# Altium schematic sheet Power.SchDoc
size A
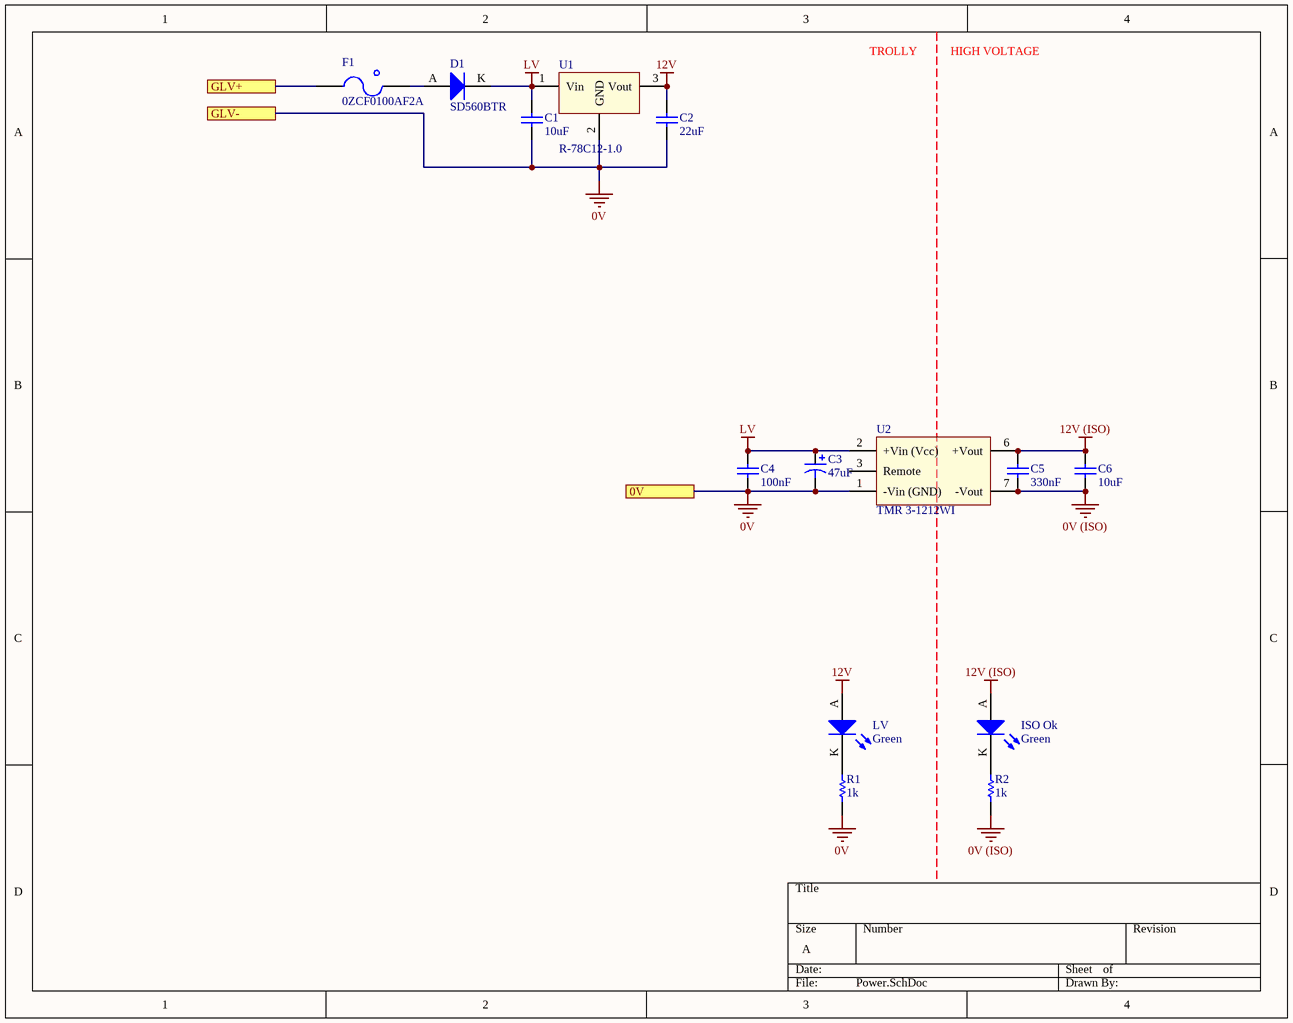
[diagram p0: Power.SchDoc]

## Parts
C1  10uF  [0805]
C2  22uF  [1206]
C3  47uF  [2924]
C4  100nF  [0805]
C5  330nF  [0805]
C6  10uF  [0805]
D1  SD560BTR  [SMB Diode]
F1  0ZCF0100AF2A  [2920]
ISO_Ok  Green  [0805 LED]
LV  Green  [0805 LED]
R1  1k  [0805]
R2  1k  [0805]
U1  R-78C12-1.0  [RECOM 3-SIP]
U2  TMR 3-1212WI  [TRECO 8-SIP]

## Ports
0V, GLV+, GLV-

## Nets
0V: C1.1 C2.1 C3.1 C4.1 R1.1 U1.2(GND) U2.1(-Vin_(GND)) ; port GLV-, port 0V
0V (ISO): C5.1 C6.1 R2.1 U2.7(-Vout)
12V: C2.2 LV.A U1.3(Vout)
12V (ISO): C5.2 C6.2 ISO_Ok.A U2.6(+Vout)
LV: C1.2 C3.2 C4.2 D1.K U1.1(Vin) U2.2(+Vin_(Vcc))
GLV+: F1.1 ; port GLV+
NetD1_A: D1.A F1.2
NetISO_Ok_K: ISO_Ok.K R2.2
NetLV_K: LV.K R1.2

Not connected (* = marked no-connect by the designer): U2 3(Remote)

## Notes on the sheet
- TROLLY
- HIGH VOLTAGE

## Library data of the parts
C1 C6 = GRM21BR6YA106KE43L: Manufacturer: muRata; Tolerance: 10%; Material: X5R; Rated Voltage: 50V; Part Number: GRM21BR6YA106KE43L; Value: 10uF; Digikey Part Number: 490-10514-6-ND
C2 = CC1206MKX5R7BB226: Manufacturer: YAGEO; Tolerance: 20%; Material: Ceramic; Rated Voltage: 16V; Part Number: CC1206MKX5R7BB226; Value: 22uF; Digikey Part Number: 311-1997-2-ND
C3 = TAJV476K035RNJ: Manufacturer: AVX Corporation; Tolerance: 10%; Material: Tantalum; Rated Voltage: 35V; Part Number: TAJV476K035RNJ; Value: 47uF; Digikey Part Number: 478-8934-1-ND
C4 = GCM21BR71H104KA37L: Manufacturer: muRata; Tolerance: ±10%; Material: X7R; Rated Voltage: 50V; Part Number: GCM21BR71H104KA37L; Value: 100nF; Digikey Part Number: 490-6064-1-ND
C5 = GCM219R71H334KA55D: Manufacturer: muRata; Tolerance: ±10%; Material: X7R; Rated Voltage: 50V; Part Number: GCM219R71H334KA55D; Value: 330nF; Digikey Part Number: 490-8045-1-ND
D1 = SD560BTR: 1.2V_F 600V 5A SMB; Manufacturer: SMC Diode Solutions; Part Number: SD560BTR; Digikey Part Number: 1655-1530-2-ND; Digikey Link: https://www.digikey.com/product-detail/en/smc-diode-solutions/SD560BTR/1655-1530-2-ND/6022620
F1 = 0ZCF0100AF2A: PTC RESET FUSE 60V 1A 292; Manufacturer: Littelfuse Inc.; Part Number: 0ZCF0100AF2A; Digikey Part Number: 507-2070-1-ND; Digikey Link: https://www.digikey.com/product-detail/en/bel-fuse-inc/0ZCF0100AF2A/507-2070-1-ND/6210547
ISO_Ok LV = SML-210FTT86: Green LED Indication - Discrete 1.75V 0805 (2012 Metric); Manufacturer: ROHM Semiconductor; Part Number: SML-210FTT86; Colour: Green; Digikey Part Number: 511-1285-1-ND; Digikey Link: https://www.digikey.com/product-detail/en/rohm-semiconductor/SML-210FTT86/511-1285-1-ND/637098
R1 R2 = RC0805FR071KL: Manufacturer: YAGEO; Tolerance: 0.01; Rated Voltage: 0.125W; Part Number: RC0805FR071KL; Value: 1k; Material: FR-07; Digikey Part Number: 311-1.00KCRCT-ND
U1 = R-78C12-1.0: 3PIN DC DC CONVERTER 12V 12W; Manufacturer: Recom; Isolation: Non-Isolated; Part Number: R-78C12-1.0; Digikey Part Number: 945-1392-5-ND; Digikey Link: https://www.digikey.com/products/en/power-supplies-board-mount/dc-dc-converters/922?k=R-78C&k=&pkeyword=R-78C&sv=0&pv1525=44&sf=0&FV=ffe0039a&quantity=&ColumnSort=0&page=1&pageSize=25
U2 = TMR 3-1212WI: DC DC CONVERTER 12V 3W; Manufacturer: Traco Power; Isolation: Isolated; Part Number: TMR 3-1212WI; Digikey Part Number: 1951-2367-ND; Digikey Link: https://www.digikey.com.au/product-detail/en/traco-power/TMR-3-1212WI/1951-2367-ND/9383402